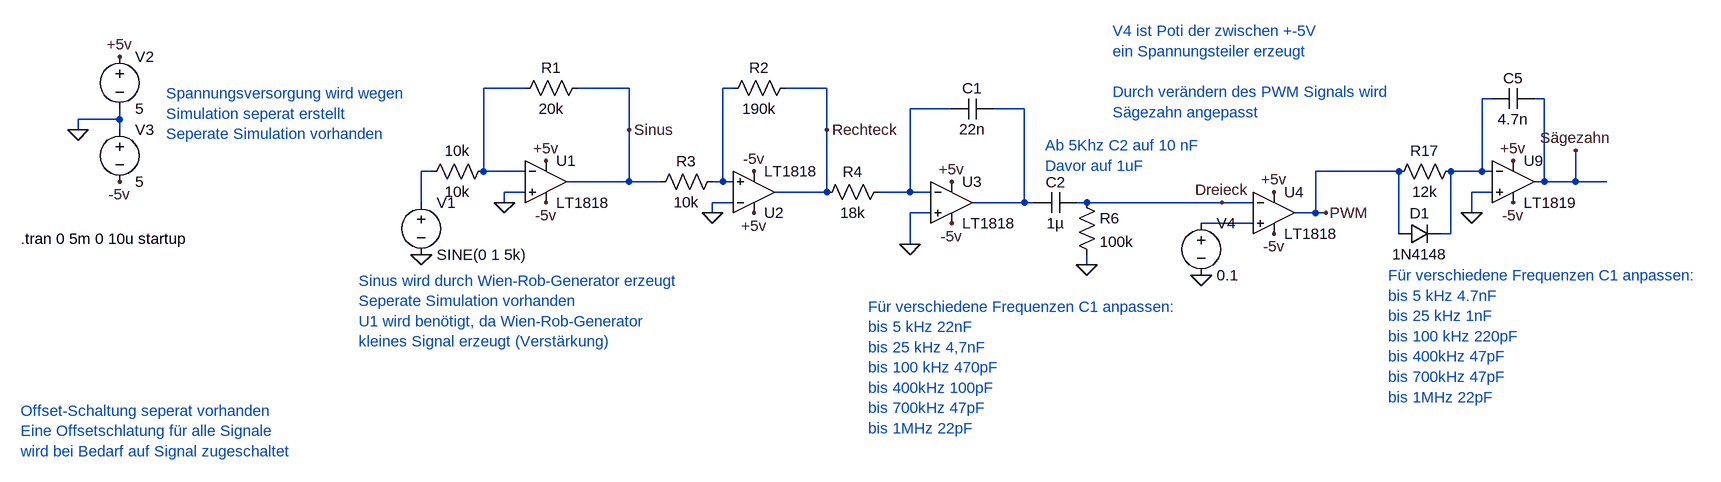
[diagram p0: schematic Signalumwandlung.asc]
Signalumwandlung.asc, the LTspice schematic file:
Version 4.1
SHEET 1 3840 1344
WIRE 608 -32 544 -32
WIRE 768 -32 688 -32
WIRE 928 -32 912 -32
WIRE 1072 -32 1008 -32
WIRE 2096 -16 2080 -16
WIRE 2176 -16 2160 -16
WIRE 1264 0 1200 0
WIRE 1376 0 1328 0
WIRE -16 16 -16 0
WIRE -16 16 -80 16
WIRE -80 32 -80 16
WIRE -16 32 -16 16
WIRE 768 32 768 -32
WIRE 1072 32 1072 -32
WIRE 464 96 448 96
WIRE 544 96 544 -32
WIRE 608 96 544 96
WIRE 1952 96 1824 96
WIRE 2080 96 2080 -16
WIRE 2080 96 2032 96
WIRE 2096 96 2080 96
WIRE 768 112 768 32
WIRE 768 112 672 112
WIRE 816 112 768 112
WIRE 912 112 912 -32
WIRE 912 112 896 112
WIRE 928 112 912 112
WIRE 2176 112 2176 -16
WIRE 2176 112 2160 112
WIRE 2224 112 2224 64
WIRE 2224 112 2176 112
WIRE 2272 112 2224 112
WIRE 608 128 576 128
WIRE 1072 128 1072 32
WIRE 1072 128 992 128
WIRE 1200 128 1200 0
WIRE 1200 128 1152 128
WIRE 1232 128 1200 128
WIRE 2096 128 2064 128
WIRE 448 144 448 96
WIRE 576 144 576 128
WIRE 928 144 896 144
WIRE 1376 144 1376 0
WIRE 1376 144 1296 144
WIRE 1392 144 1376 144
WIRE 1472 144 1456 144
WIRE 1680 144 1472 144
WIRE 1728 144 1680 144
WIRE 896 160 896 144
WIRE 1232 160 1200 160
WIRE 1824 160 1824 96
WIRE 1824 160 1792 160
WIRE 1840 160 1824 160
WIRE 2064 160 2064 128
WIRE 1728 176 1648 176
WIRE 1952 192 1952 96
WIRE 2032 192 2032 96
WIRE 2032 192 2016 192
WIRE 1200 208 1200 160
WIRE 1472 240 1472 224
FLAG 448 224 0
FLAG -80 32 0
FLAG -16 -80 +5v
FLAG -16 112 -5v
FLAG 640 144 -5v
FLAG 640 80 +5v
FLAG 576 144 0
FLAG 896 160 0
FLAG 960 160 +5v
FLAG 960 96 -5v
FLAG 1264 176 -5v
FLAG 1264 112 +5v
FLAG 1200 208 0
FLAG 1648 256 0
FLAG 1760 128 +5v
FLAG 1760 192 -5v
FLAG 1680 144 Dreieck
FLAG 1840 160 PWM
FLAG 1072 32 Rechteck
FLAG 768 32 Sinus
FLAG 1472 240 0
FLAG 2064 160 0
FLAG 2128 80 +5v
FLAG 2128 144 -5v
FLAG 2224 64 Sägezahn
SYMBOL voltage 448 128 R0
WINDOW 123 0 0 Left 0
WINDOW 39 0 0 Left 0
SYMATTR InstName V1
SYMATTR Value SINE(0 1 5k)
SYMBOL voltage -16 -96 R0
WINDOW 123 0 0 Left 0
WINDOW 39 0 0 Left 0
SYMATTR InstName V2
SYMATTR Value 5
SYMBOL voltage -16 16 R0
WINDOW 123 0 0 Left 0
WINDOW 39 0 0 Left 0
SYMATTR InstName V3
SYMATTR Value 5
SYMBOL OpAmps\\LT1818 640 112 R0
SYMATTR InstName U1
SYMBOL res 704 -48 R90
WINDOW 0 0 56 VBottom 2
WINDOW 3 32 56 VTop 2
SYMATTR InstName R1
SYMATTR Value 20k
SYMBOL res 560 80 R90
WINDOW 0 0 56 VBottom 2
WINDOW 3 32 56 VTop 2
SYMATTR InstName 10k
SYMATTR Value 10k
SYMBOL OpAmps\\LT1818 960 128 M180
SYMATTR InstName U2
SYMBOL res 1024 -48 R90
WINDOW 0 0 56 VBottom 2
WINDOW 3 32 56 VTop 2
SYMATTR InstName R2
SYMATTR Value 190k
SYMBOL res 912 96 R90
WINDOW 0 0 56 VBottom 2
WINDOW 3 32 56 VTop 2
SYMATTR InstName R3
SYMATTR Value 10k
SYMBOL cap 1328 -16 R90
WINDOW 0 0 32 VBottom 2
WINDOW 3 32 32 VTop 2
SYMATTR InstName C1
SYMATTR Value 22n
SYMBOL res 1168 112 R90
WINDOW 0 0 56 VBottom 2
WINDOW 3 32 56 VTop 2
SYMATTR InstName R4
SYMATTR Value 18k
SYMBOL OpAmps\\LT1818 1264 144 R0
SYMATTR InstName U3
SYMBOL OpAmps\\LT1818 1760 160 R0
SYMATTR InstName U4
SYMBOL voltage 1648 160 R0
WINDOW 123 0 0 Left 0
WINDOW 39 0 0 Left 0
SYMATTR InstName V4
SYMATTR Value 0.1
SYMBOL cap 1456 128 R90
WINDOW 0 0 32 VBottom 2
WINDOW 3 32 32 VTop 2
SYMATTR InstName C2
SYMATTR Value 1µ
SYMBOL res 1456 128 R0
SYMATTR InstName R6
SYMATTR Value 100k
SYMBOL lib\\sym\\OpAmps\\LT1819 2128 112 R0
SYMATTR InstName U9
SYMBOL res 2048 80 R90
WINDOW 0 0 56 VBottom 2
WINDOW 3 32 56 VTop 2
SYMATTR InstName R17
SYMATTR Value 12k
SYMBOL cap 2160 -32 R90
WINDOW 0 0 32 VBottom 2
WINDOW 3 32 32 VTop 2
SYMATTR InstName C5
SYMATTR Value 4.7n
SYMBOL diode 1952 208 R270
WINDOW 0 32 32 VTop 2
WINDOW 3 0 32 VBottom 2
SYMATTR InstName D1
SYMATTR Value 1N4148
TEXT -168 200 Left 2 !.tran 0 5m 0 10u startup
TEXT 1936 256 Left 2 ;Für verschiedene Frequenzen C1 anpassen:\nbis 5 kHz 4.7nF\nbis 25 kHz 1nF\nbis 100 kHz 220pF\nbis 400kHz 47pF\nbis 700kHz 47pF\nbis 1MHz 22pF
TEXT 1136 304 Left 2 ;Für verschiedene Frequenzen C1 anpassen:\nbis 5 kHz 22nF\nbis 25 kHz 4,7nF\nbis 100 kHz 470pF\nbis 400kHz 100pF\nbis 700kHz 47pF\nbis 1MHz 22pF
TEXT 1408 56 Left 2 ;Ab 5Khz C2 auf 10 nF\nDavor auf 1uF
TEXT 1512 -120 Left 2 ;V4 ist Poti der zwischen +-5V \nein Spannungsteiler erzeugt\n \nDurch verändern des PWM Signals wird \nSägezahn angepasst
TEXT 352 264 Left 2 ;Sinus wird durch Wien-Rob-Generator erzeugt \nSeperate Simulation vorhanden\nU1 wird benötigt, da Wien-Rob-Generator \nkleines Signal erzeugt (Verstärkung)
TEXT 56 -24 Left 2 ;Spannungsversorgung wird wegen\nSimulation seperat erstellt\nSeperate Simulation vorhanden
TEXT -168 464 Left 2 ;Offset-Schaltung seperat vorhanden\nEine Offsetschlatung für alle Signale\nwird bei Bedarf auf Signal zugeschaltet

The netlist it stands for:
* Signalumwandlung.asc
V1 N006 0 SINE(0 1 5k)
V2 +5v 0 5
V3 0 -5v 5
X§U1 0 N001 Sinus +5v -5v LT1818  ; pins In+ In- OUT V+ V-
R1 Sinus N001 20k
R§10k N001 N006 10k
X§U2 N002 0 Rechteck +5v -5v LT1818  ; pins In+ In- OUT V+ V-
R2 Rechteck N002 190k
R3 N002 Sinus 10k
C1 N005 N004 22n
R4 N004 Rechteck 18k
X§U3 0 N004 N005 +5v -5v LT1818  ; pins In+ In- OUT V+ V-
X§U4 N007 Dreieck PWM +5v -5v LT1818  ; pins In+ In- OUT V+ V-
V4 N007 0 0.1
C2 Dreieck N005 1µ
R6 Dreieck 0 100k
* U9: LT1819 (symbol lib\sym\OpAmps\LT1819 not available, pins judged from their places): In+=0 In-=N003 V+=+5v V-=-5v OUT=Sägezahn
R17 N003 PWM 12k
C5 Sägezahn N003 4.7n
D1 PWM N003 1N4148
.model D D
.lib standard.dio
.tran 0 5m 0 10u startup
* Für verschiedene Frequenzen C1 anpassen:
* bis 5 kHz 4.7nF
* bis 25 kHz 1nF
* bis 100 kHz 220pF
* bis 400kHz 47pF
* bis 700kHz 47pF
* bis 1MHz 22pF
* Für verschiedene Frequenzen C1 anpassen:
* bis 5 kHz 22nF
* bis 25 kHz 4,7nF
* bis 100 kHz 470pF
* bis 400kHz 100pF
* bis 700kHz 47pF
* bis 1MHz 22pF
* Ab 5Khz C2 auf 10 nF
* Davor auf 1uF
* V4 ist Poti der zwischen +-5V
* ein Spannungsteiler erzeugt
* Durch verändern des PWM Signals wird
* Sägezahn angepasst
* Sinus wird durch Wien-Rob-Generator erzeugt
* Seperate Simulation vorhanden
* U1 wird benötigt, da Wien-Rob-Generator
* kleines Signal erzeugt (Verstärkung)
* Spannungsversorgung wird wegen
* Simulation seperat erstellt
* Seperate Simulation vorhanden
* Offset-Schaltung seperat vorhanden
* Eine Offsetschlatung für alle Signale
* wird bei Bedarf auf Signal zugeschaltet
.lib LTC2.lib
.backanno
.end